# EAGLE design DMX_isolated.v3 (EAGLE 5.11)
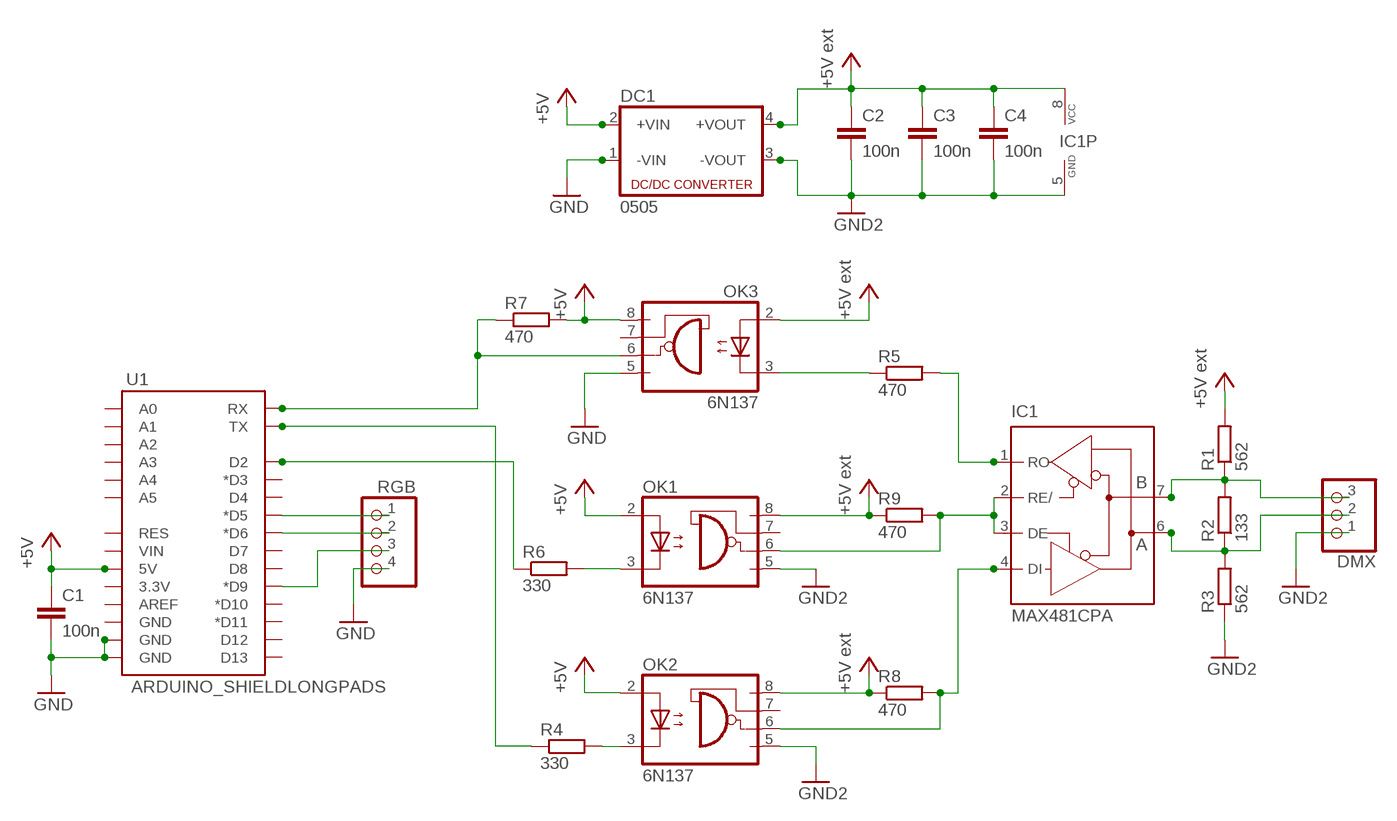
[diagram p0: schematic, sheet 1]

## Parts
C1  100n  C5/3  [C5B3]
C2  100n  C7.5/3  [C7.5B3]
C3  100n  C7.5/3  [C7.5B3]
C4  100n  C7.5/3  [C7.5B3]
DC1  0505  NME  [NME]
DMX  PINHD-1X3  [1X03]
IC1  MAX481CPA  [DIL08]
OK1  6N137  [DIL08]
OK2  6N137  [DIL08]
OK3  6N137  [DIL08]
R1  562  R-EU_0207/10  [0207/10]
R2  133  R-EU_0207/10  [0207/10]
R3  562  R-EU_0207/10  [0207/10]
R4  330  R-EU_0207/10  [0207/10]
R5  470  R-EU_0207/10  [0207/10]
R6  330  R-EU_0207/10  [0207/10]
R7  470  R-EU_0207/10  [0207/10]
R8  470  R-EU_0207/10  [0207/10]
R9  470  R-EU_0207/10  [0207/10]
RGB  PINHD-1X4  [1X04]
U1  ARDUINO_SHIELDLONGPADS  [DUEMILANOVE_SHIELD_LONGPADS]

## Nets
+5V: C1.1 DC1.2(+VIN) OK1.2(A) OK2.2(A) OK3.8(VCC) R7.2 U1.5V
+5V_EXT: C2.1 C3.1 C4.1 DC1.4(+VOUT) IC1.8(VCC) OK1.8(VCC) OK2.8(VCC) OK3.2(A) R1.2 R8.1 R9.1 ; supply symbol labelled +5V ext
D2: R4.1 U1.TX
GND: C1.2 DC1.1(-VIN) OK3.5(GND) RGB.4 U1.GND@0(GND) U1.GND@1(GND)
GND_EXT: C2.2 C3.2 C4.2 DC1.3(-VOUT) DMX.1 IC1.5(GND) OK1.5(GND) OK2.5(GND) R3.1 ; supply symbol labelled GND2
N$1: R6.1 U1.D2
N$2: RGB.1 U1.D5(*D5)
N$3: OK1.3(C) R6.2
N$4: RGB.2 U1.D6(*D6)
N$5: OK2.3(C) R4.2
N$6: IC1.2(RE/) IC1.3(DE) OK1.6(VO) R9.2
N$7: IC1.4(DI) OK2.6(VO) R8.2
N$8: OK3.3(C) R5.1
N$9: IC1.1(RO) R5.2
N$10: OK3.6(VO) R7.1 U1.RX
N$11: RGB.3 U1.D9(*D9)
N$15: DMX.3 IC1.7(B) R1.1 R2.2
N$17: DMX.2 IC1.6(A) R2.1 R3.2
Unconnected: OK1.7(VE) OK2.7(VE) OK3.7(VE) U1.3.3V U1.A0 U1.A1 U1.A2 U1.A3 U1.A4 U1.A5 U1.AREF U1.D3(*D3) U1.D4 U1.D7 U1.D8 U1.D10(*D10) U1.D11(*D11) U1.D12 U1.D13 U1.GND@2(GND) U1.RES U1.VIN

## Library data of the parts
C1-C4 = capacitor-wima:C: CAPACITOR naming: grid - package width
DC1 = dc-dc-converter:NME: DC-DC CONVERTER; MF: C & D TECHNOLOGIES, INC; MPN: NME1205D; OC_FARNELL: 1021466; OC_NEWARK: 98B8198
DMX = pinhead:PINHD-1X3: PIN HEADER
IC1 = maxim:MAX481CPA: RS485 TRANSEIVER; MPN: MAX481CPA+; OC_FARNELL: unknown; OC_NEWARK: 99K3445
OK1-OK3 = optocoupler:6N137: MOTOROLA OPTO COUPLER; MPN: 6N137; OC_FARNELL: 1328376; OC_NEWARK: 52M1895
R1-R9 = resistor:R-EU_: RESISTOR, European symbol
RGB = pinhead:PINHD-1X4: PIN HEADER
U1 = SparkFun:ARDUINO_SHIELD

## Net classes
1 power: width 0.508 mm

## Board
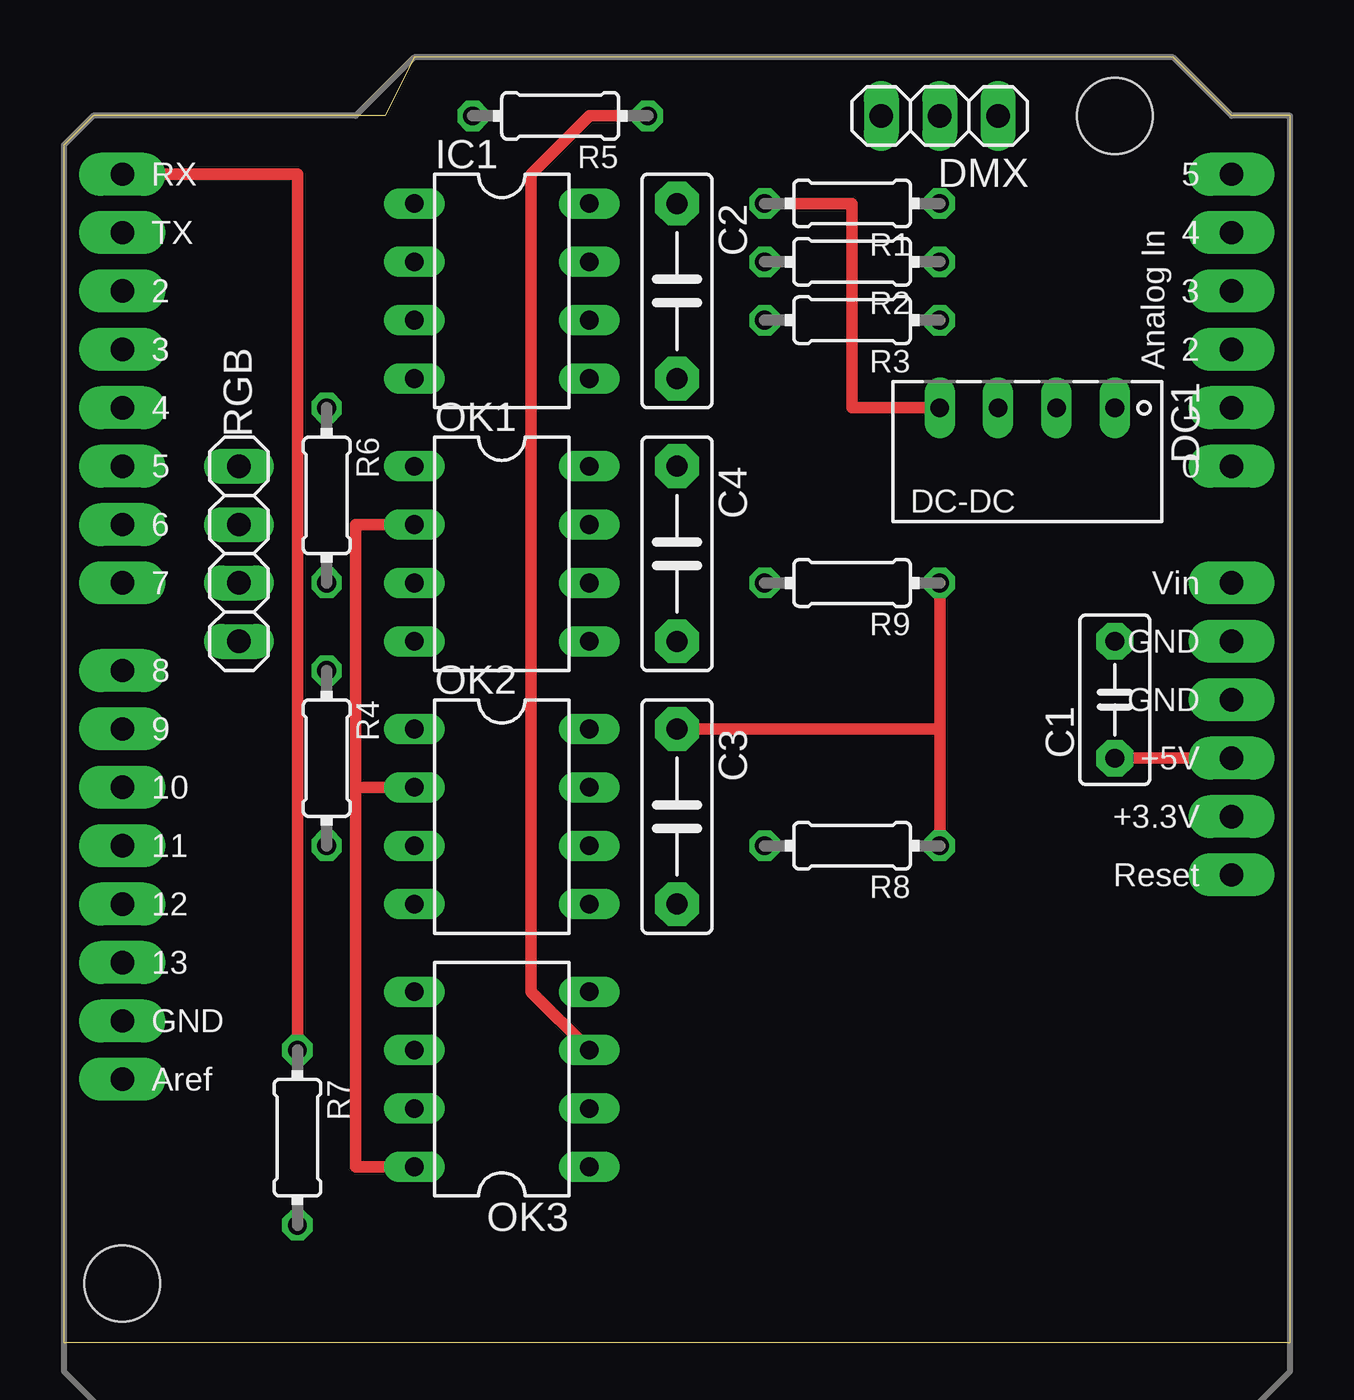
[diagram p1: board, top side]
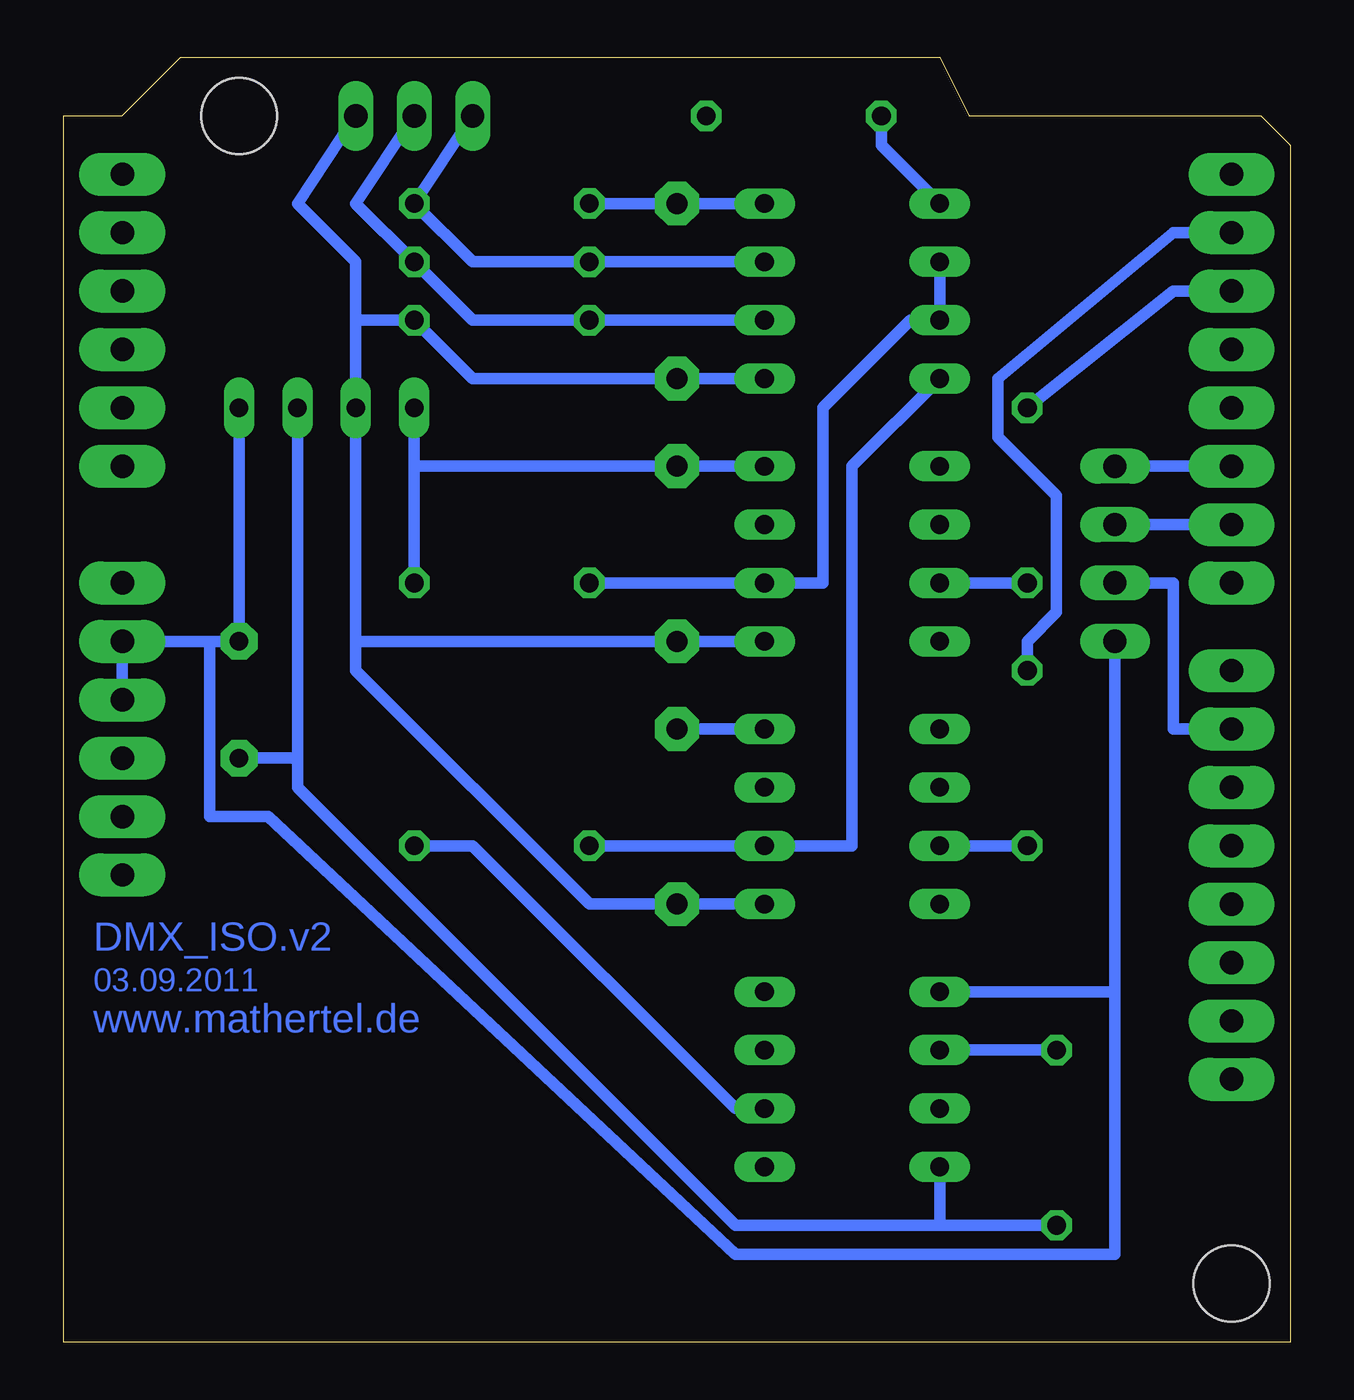
[diagram p2: board, bottom side, seen from below]

Size 53.34 x 55.88 mm. Coordinates in mm from the lower left corner, seen from the top.
Outline: 53.34,0 53.34,53.34 50.8,53.34 48.26,55.88 15.24,55.88 13.97,53.34 1.27,53.34 0,52.07 0,0 53.34,0
Copper layers (1*16): Top 0.035mm / dielectric 1.5mm / Bottom 0.035mm
Design rules "default *": minimum track width 20mil, minimum drill 24mil, track to track 8mil, track to pad 8mil, pad to pad 8mil, via to via 8mil, smd to smd 8mil, copper to edge 25mil, drill to drill 8mil, minimum pad ring 10mil, minimum via ring 8mil, stop-mask expansion 4mil, vias tented up to drill 0mil, thermal gap 10mil

### Footprints (pad centres in the part's own frame; a part is rotated, then mirrored left to right if it is on the bottom)
C5B3 = drill 0.813 pad 1.6 octagon: 1 -2.54,0; 2 2.54,0
C7.5B3 = drill 0.914 pad 1.905 octagon: 1 -3.81,0; 2 3.81,0
NME = drill 0.813 long: 1 0,3.81; 2 0,1.27; 3 0,-1.27; 4 0,-3.81
1X03 = drill 1.016 long: 1 -2.54,0; 2 0,0; 3 2.54,0
DIL08 = drill 0.813 long: 1 -3.81,-3.81; 2 -1.27,-3.81; 3 1.27,-3.81; 4 3.81,-3.81; 5 3.81,3.81; 6 1.27,3.81; 7 -1.27,3.81; 8 -3.81,3.81
0204/7 = drill 0.813 octagon: 1 -3.81,0; 2 3.81,0
1X04 = drill 1.016 long: 1 -3.81,0; 2 -1.27,0; 3 1.27,0; 4 3.81,0
DUEMILANOVE_SHIELD_LONGPADS = drill 1.016 pad 1.88 long: 3.3V 50.8,26.67; 5V 50.8,29.21; A0 50.8,41.91; A1 50.8,44.45; A2 50.8,46.99; A3 50.8,49.53; A4 50.8,52.07; A5 50.8,54.61; AREF 2.54,15.24; D2 2.54,49.53; D3 2.54,46.99; D4 2.54,44.45; D5 2.54,41.91; D6 2.54,39.37; D7 2.54,36.83; D8 2.54,33.02; D9 2.54,30.48; D10 2.54,27.94; D11 2.54,25.4; D12 2.54,22.86; D13 2.54,20.32; GND@0 50.8,31.75; GND@1 50.8,34.29; GND@2 2.54,17.78; RES 50.8,24.13; RX 2.54,54.61; TX 2.54,52.07; VIN 50.8,36.83 | hole 3.302: 45.72,57.15; 2.54,6.35

### Placement (x,y rotation side)
C1  45.72,27.94 90 top
C2  26.67,45.72 270 top
C3  26.67,22.86 270 top
C4  26.67,34.29 270 top
DC1  41.91,40.64 270 top
DMX  38.1,53.34 180 top
IC1  19.05,45.72 270 top
OK1  19.05,34.29 270 top
OK2  19.05,22.86 270 top
OK3  19.05,11.43 90 top
R1  562  [0204/7]  34.29,49.53 180 top
R2  133  [0204/7]  34.29,46.99 180 top
R3  562  [0204/7]  34.29,44.45 180 top
R4  330  [0204/7]  11.43,25.4 270 top
R5  470  [0204/7]  21.59,53.34 180 top
R6  330  [0204/7]  11.43,36.83 270 top
R7  470  [0204/7]  10.16,8.89 270 top
R8  470  [0204/7]  34.29,21.59 180 top
R9  470  [0204/7]  34.29,33.02 180 top
RGB  7.62,34.29 270 top
U1  0,-3.81 0 top

### Tracks (layer width: path | path; a pad name or v marks a point on that pad's centre or on a via)
+5V
  Top 0.508: C1.1 U1.5V | OK3.8 12.7,7.62 12.7,24.13 | 12.7,24.13 OK2.2 | 12.7,24.13 12.7,35.56 OK1.2
  Bottom 0.508: R7.2 15.24,5.08 | 15.24,5.08 OK3.8 | 43.18,25.4 C1.1 | 43.18,25.4 43.18,24.13 24.13,5.08 15.24,5.08 | 43.18,25.4 DC1.2
+5V_EXT
  Top 0.508: DC1.4 34.29,40.64 34.29,49.53 R1.2 | 38.1,26.67 R9.1 | R8.1 38.1,26.67 | 38.1,26.67 C3.1
  Bottom 0.508: IC1.8 C2.1 R1.2 | C3.1 OK2.8 | OK1.8 C4.1 38.1,38.1 | R9.1 38.1,38.1 | 38.1,38.1 DC1.4 | R8.1 35.56,21.59 24.13,10.16 OK3.2
D2
  Bottom 0.508: R4.1 11.43,30.48 10.16,31.75 10.16,36.83 12.7,39.37 12.7,41.91 5.08,48.26 U1.TX
GND
  Bottom 0.508: U1.GND@0 U1.GND@1 46.99,30.48 | DC1.1 C1.2 46.99,30.48 | 46.99,30.48 46.99,22.86 44.45,22.86 24.13,3.81 7.62,3.81 7.62,15.24 | 7.62,15.24 RGB.4 | OK3.5 7.62,15.24
GND_EXT
  Bottom 0.508: DMX.1 43.18,49.53 40.64,46.99 40.64,44.45 | 40.64,44.45 R3.1 35.56,41.91 C2.2 IC1.5 | 40.64,44.45 DC1.3 40.64,30.48 | 40.64,30.48 C4.2 OK1.5 | 40.64,30.48 40.64,29.21 30.48,19.05 C3.2 OK2.5
N$1
  Bottom 0.508: R6.1 5.08,45.72 U1.D2
N$2
  Bottom 0.508: U1.D5 RGB.1
N$3
  Bottom 0.508: R6.2 OK1.3
N$4
  Bottom 0.508: U1.D6 RGB.2
N$5
  Bottom 0.508: 13.97,21.59 OK2.3 R4.2
N$6
  Bottom 0.508: IC1.2 IC1.3 16.51,44.45 20.32,40.64 20.32,33.02 OK1.6 R9.2
N$7
  Bottom 0.508: IC1.4 19.05,38.1 19.05,21.59 OK2.6 R8.2
N$8
  Top 0.508: R5.1 22.86,53.34 20.32,50.8 20.32,15.24 OK3.3
N$9
  Bottom 0.508: IC1.1 17.78,52.07 R5.2
N$10
  Top 0.508: U1.RX 10.16,50.8 R7.1
  Bottom 0.508: R7.1 OK3.6
N$11
  Bottom 0.508: RGB.3 5.08,33.02 5.08,26.67 U1.D9
N$15
  Bottom 0.508: DMX.3 R1.1 35.56,46.99 R2.2 IC1.7
N$17
  Bottom 0.508: DMX.2 40.64,49.53 R2.1 35.56,44.45 R3.2 IC1.6

### Text on the board
Bottom: DMX_ISO.v2 | 03.09.2011 | www.mathertel.de